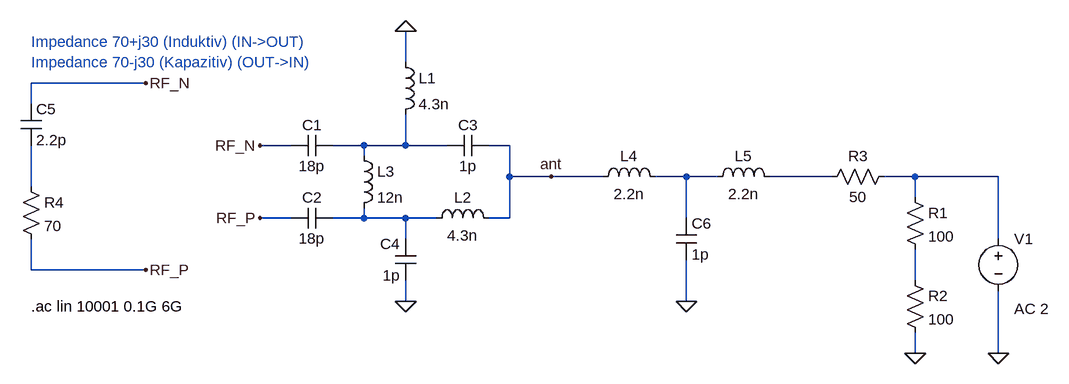
[diagram p0: schematic Antenne_2.4GHz_Serie_Zusatz.asc]
Antenne_2.4GHz_Serie_Zusatz.asc, the LTspice schematic file:
Version 4
SHEET 1 880 680
WIRE -192 -64 -192 -112
WIRE -592 -32 -768 -32
WIRE -768 0 -768 -32
WIRE -368 64 -416 64
WIRE -256 64 -304 64
WIRE -192 64 -192 16
WIRE -192 64 -256 64
WIRE -128 64 -192 64
WIRE -32 64 -64 64
WIRE -256 80 -256 64
WIRE -32 112 -32 64
WIRE 32 112 -32 112
WIRE 112 112 32 112
WIRE 240 112 192 112
WIRE 288 112 240 112
WIRE 464 112 368 112
WIRE 592 112 544 112
WIRE 720 112 592 112
WIRE -768 128 -768 64
WIRE 592 144 592 112
WIRE -368 176 -416 176
WIRE -256 176 -256 160
WIRE -256 176 -304 176
WIRE -192 176 -256 176
WIRE -144 176 -192 176
WIRE -32 176 -32 112
WIRE -32 176 -64 176
WIRE 240 176 240 112
WIRE -192 208 -192 176
WIRE 720 208 720 112
WIRE -768 256 -768 208
WIRE -592 256 -768 256
WIRE 592 272 592 224
WIRE -192 304 -192 272
WIRE 240 304 240 240
WIRE 592 384 592 352
WIRE 720 384 720 288
FLAG -192 -112 0
FLAG -416 64 RF_N
FLAG -416 176 RF_P
FLAG 32 112 ant
FLAG -592 -32 RF_N
FLAG -592 256 RF_P
FLAG -192 304 0
FLAG 592 384 0
FLAG 720 384 0
FLAG 240 304 0
SYMBOL cap -304 48 R90
WINDOW 0 0 32 VBottom 2
WINDOW 3 32 32 VTop 2
SYMATTR InstName C1
SYMATTR Value 18p
SYMBOL cap -304 160 R90
WINDOW 0 0 32 VBottom 2
WINDOW 3 32 32 VTop 2
SYMATTR InstName C2
SYMATTR Value 18p
SYMBOL cap -64 48 R90
WINDOW 0 0 32 VBottom 2
WINDOW 3 32 32 VTop 2
SYMATTR InstName C3
SYMATTR Value 1p
SYMBOL ind -208 -80 R0
SYMATTR InstName L1
SYMATTR Value 4.3n
SYMBOL ind -160 192 R270
WINDOW 0 32 56 VTop 2
WINDOW 3 5 56 VBottom 2
SYMATTR InstName L2
SYMATTR Value 4.3n
SYMBOL cap -176 272 R180
WINDOW 0 24 56 Left 2
WINDOW 3 24 8 Left 2
SYMATTR InstName C4
SYMATTR Value 1p
SYMBOL cap -784 0 R0
SYMATTR InstName C5
SYMATTR Value 2.2p
SYMBOL res 576 128 R0
SYMATTR InstName R1
SYMATTR Value 100
SYMBOL res 576 256 R0
SYMATTR InstName R2
SYMATTR Value 100
SYMBOL voltage 720 192 R0
WINDOW 123 24 124 Left 2
WINDOW 39 0 0 Left 2
SYMATTR Value2 AC 2
SYMATTR InstName V1
SYMATTR Value ""
SYMBOL res 560 96 R90
WINDOW 0 0 56 VBottom 2
WINDOW 3 32 56 VTop 2
SYMATTR InstName R3
SYMATTR Value 50
SYMBOL res -784 112 R0
SYMATTR InstName R4
SYMATTR Value 70
SYMBOL ind -272 64 R0
SYMATTR InstName L3
SYMATTR Value 12n
SYMBOL ind 96 128 R270
WINDOW 0 32 56 VTop 2
WINDOW 3 5 56 VBottom 2
SYMATTR InstName L4
SYMATTR Value 2.2n
SYMBOL cap 224 176 R0
SYMATTR InstName C6
SYMATTR Value 1p
SYMBOL ind 272 128 R270
WINDOW 0 32 56 VTop 2
WINDOW 3 5 56 VBottom 2
SYMATTR InstName L5
SYMATTR Value 2.2n
TEXT -768 312 Left 2 !.ac lin 10001 0.1G 6G
TEXT -768 -96 Left 2 ;Impedance 70+j30 (Induktiv) (IN->OUT)
TEXT -768 -64 Left 2 ;Impedance 70-j30 (Kapazitiv) (OUT->IN)

The netlist it stands for:
* Antenne_2.4GHz_Serie_Zusatz.asc
C1 N001 RF_N 18p
C2 N006 RF_P 18p
C3 ant N001 1p
L1 0 N001 4.3n
L2 N006 ant 4.3n
C4 0 N006 1p
C5 RF_N N005 2.2p
R1 N004 N007 100
R2 N007 0 100
V1 N004 0 AC 2
R3 N004 N003 50
R4 N005 RF_P 70
L3 N001 N006 12n
L4 ant N002 2.2n
C6 N002 0 1p
L5 N002 N003 2.2n
.ac lin 10001 0.1G 6G
* Impedance 70+j30 (Induktiv) (IN->OUT)
* Impedance 70-j30 (Kapazitiv) (OUT->IN)
.backanno
.end